# EAGLE design LEDPoet (EAGLE 6.1)
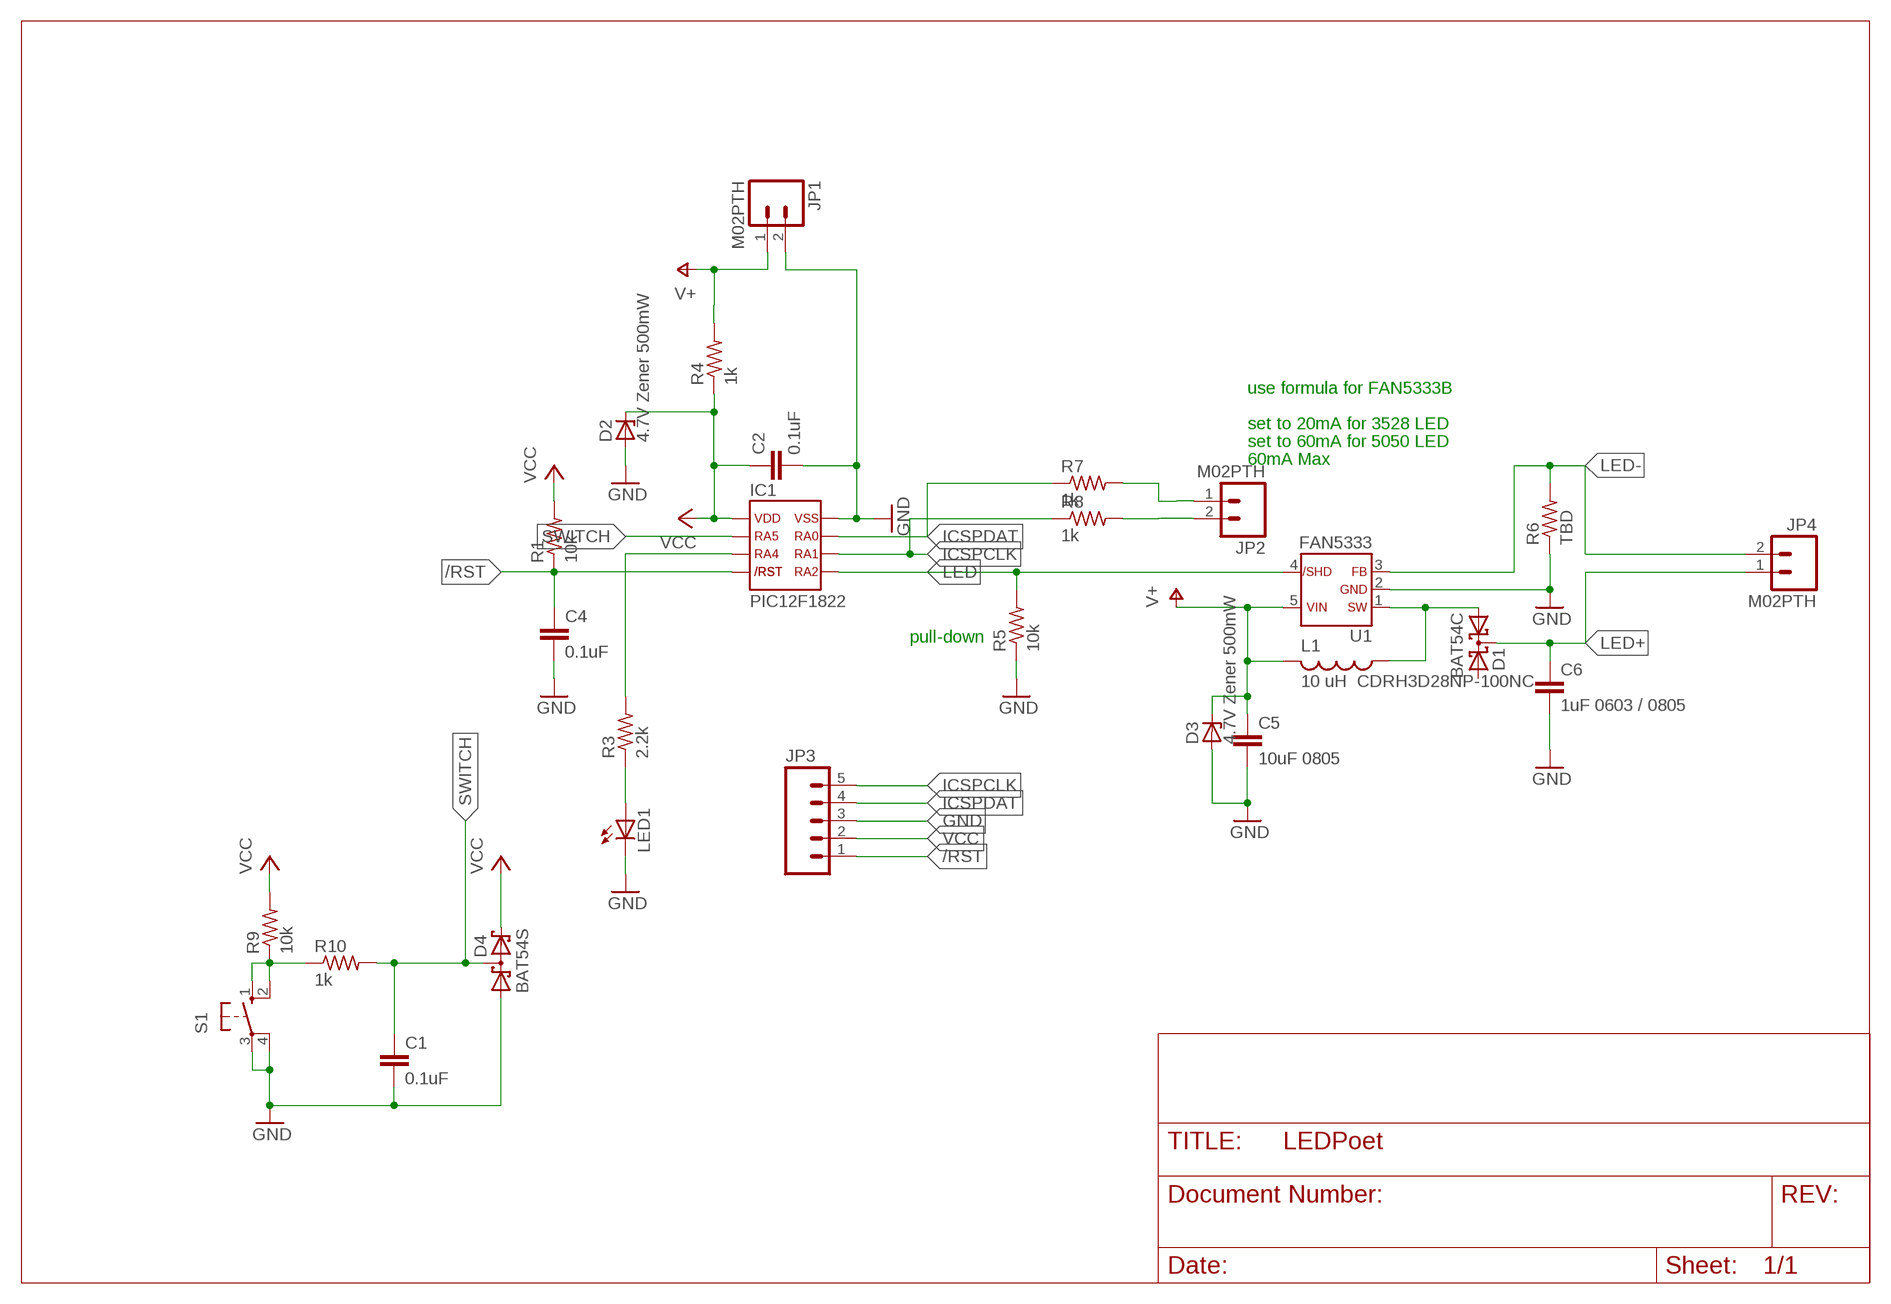
[diagram p0: schematic, sheet 1]

## Parts
C1  0.1uF  C0603(1608)  [C0603(1608)]
C2  0.1uF  C0603(1608)  [C0603(1608)]
C4  0.1uF  C0603(1608)  [C0603(1608)]
C5  10uF 0805  C0805(2012)  [C0805(2012)]
C6  1uF 0603 / 0805  C0805(2012)  [C0805(2012)]
D1  BAT54C  [SOT23]
D2  4.7V Zener 500mW  ZENER-DIODE  [SOD-123]
D3  4.7V Zener 500mW  ZENER-DIODE  [SOD-123]
D4  BAT54S  [SOT23]
IC1  PIC12F1822  [SO8]
JP1  M02PTH  [1X02]
JP2  M02PTH  [1X02]
JP3  M05PTH  [1X05]
JP4  M02PTH  [1X02]
L1  10 uH CDRH3D28NP-100NC  L  [CDRH3D18]
LED1  LED0603  [LED-0603]
R1  10k  R0603(1608)  [R0603(1608)]
R3  2.2k  R0603(1608)  [R0603(1608)]
R4  1k  R0603(1608)  [R0603(1608)]
R5  10k  R0603(1608)  [R0603(1608)]
R6  TBD  R0603(1608)  [R0603(1608)]
R7  1k  R0603(1608)  [R0603(1608)]
R8  1k  R0603(1608)  [R0603(1608)]
R9  10k  R0603(1608)  [R0603(1608)]
R10  1k  R0603(1608)  [R0603(1608)]
S1  40-XX  [B3F-40XX]
U1  FAN5333  [SOT-23-5]

## Nets
/RST: C4.1 IC1.4 JP3.1 R1.1
GND: C1.2 C2.2 C4.2 C5.2 C6.2 D2.A D3.A D4.1(A1) IC1.8 JP1.2 JP3.3 LED1.C R5.1 R6.1 S1.3(P) S1.4(P1) U1.2
ICSPCLK: IC1.6 JP3.5 R8.1
ICSPDAT: IC1.7 JP3.4 R7.1
LED: IC1.5 R5.2 U1.4
LED+: C6.1 D1.3(CC) JP4.1
LED-: JP4.2 R6.2 U1.3
N$2: LED1.A R3.1
N$3: IC1.3 R3.2
N$4: JP2.1 R7.2
N$5: D1.1(A1) L1.P$1 U1.1
N$6: R9.1 R10.1 S1.1(S) S1.2(S1)
N$7: JP2.2 R8.2
SWITCH: C1.1 D4.3(C1A2) IC1.2 R10.2
V+: C5.1 D3.C JP1.1 L1.P$2 R4.2 U1.5
VCC: C2.1 D2.C D4.2(C2) IC1.1 JP3.2 R1.2 R4.1 R9.2
Unconnected: D1.2(A2)

## Notes on the sheet
- use formula for FAN5333B
- set to 20mA for 3528 LED
- set to 60mA for 5050 LED
- 60mA Max
- pull-down

## Library data of the parts
C1 C2 C4 = WaterDrop:C
C5 C6 = LEDPoet:C
D1 = diode:BAT54C: Schottky Diodes Source: Fairchild .. BAT54.pdf
D2 D3 = LEDPoet:ZENER-DIODE
D4 = OSSI:BAT54S: Schottky Diodes Pin connection corrected 2011-05-04 Source: Fairchild .. BAT54.pdf
IC1 = WaterDrop:PIC12F1822
JP1 JP2 JP4 = SparkFun-Connectors:M02: Standard 2-pin 0.1" header. Use with - straight break away headers ( PRT-00116) - right angle break away headers (PRT-00553) - swiss pins (PRT-00743) - machine pins (PRT-00117) - female headers (PRT-00115) Molex polarized connector foot print use with: PRT-08233 with associated crimp pins and housings. 2.54_SCREWTERM for use with PRT-10571. 3.5mm Screw Terminal footprints for PRT-08084 5mm Screw Terminal footprints for use with PRT-08433
JP3 = SparkFun-Connectors:M05: Header 5 Standard 5-pin 0.1" header. Use with straight break away headers (SKU : PRT-00116), right angle break away headers (PRT-00553), swiss pins (PRT-00743), machine pins (PRT-00117), and female headers (PRT-00115). Molex polarized connector foot print use with SKU : PRT-08230 with associated crimp pins and housings.
L1 = OSSI:L
LED1 = SparkFun:LED: LEDs Standard schematic elements and footprints for 5mm, 3mm, 1206, and 0603 sized LEDs. 5mm - Spark Fun Electronics SKU : COM-00529 (and others)
R1 R3-R10 = WaterDrop:R
S1 = switch-omron:40-XX: OMRON SWITCH; MF: OMRON COMPONENTS USA; MPN: B3F-4000; OC_FARNELL: 176434; OC_NEWARK: 36K3105
U1 = LEDPoet:FAN5333

## Board
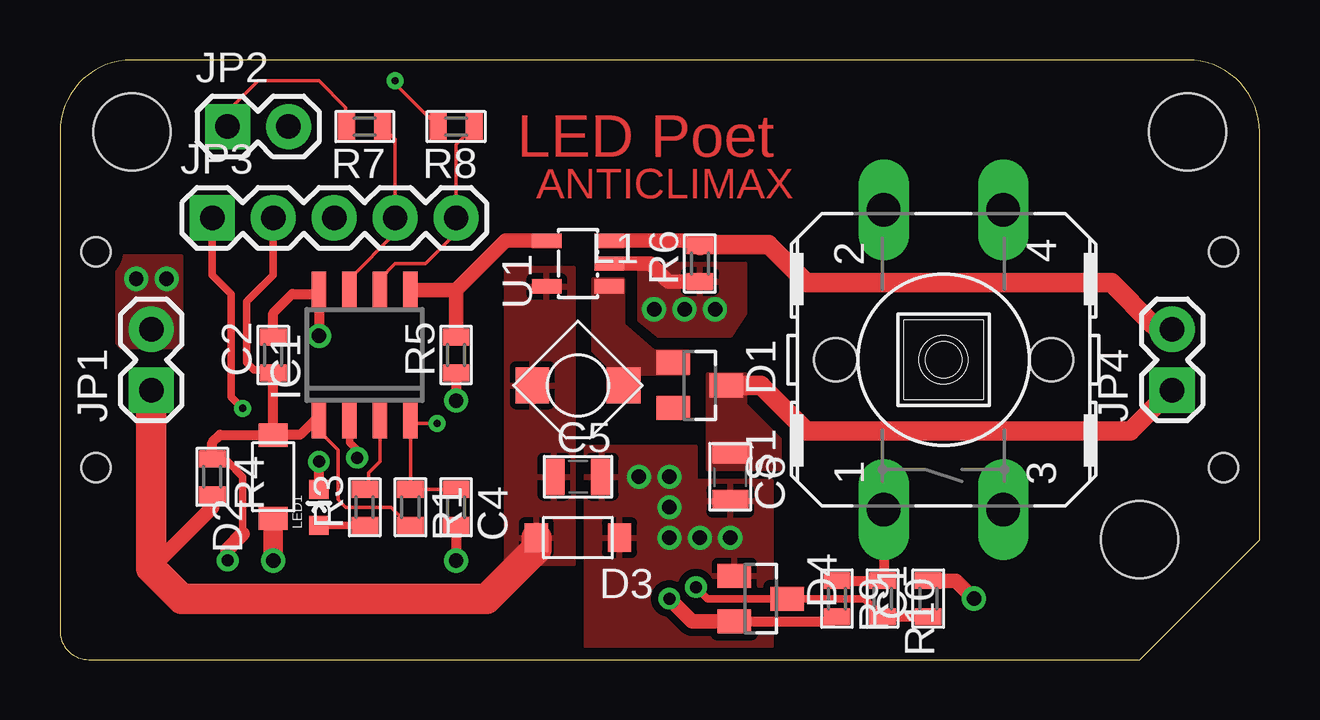
[diagram p1: board, top side]
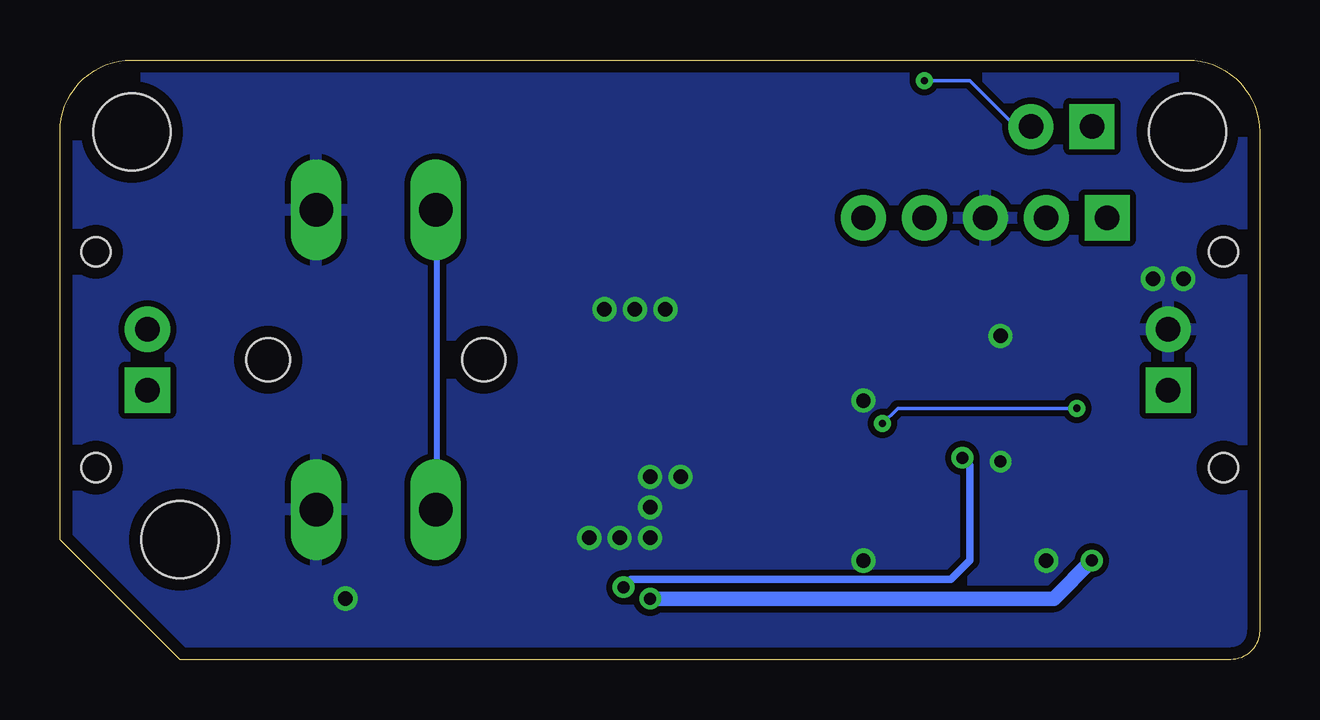
[diagram p2: board, bottom side, seen from below]

Size 50 x 25 mm. Coordinates in mm from the lower left corner, seen from the top.
Outline: 0,22 0,1.2 arc90 1.2,0 45,0 50,5 50,22 arc90 47,25 3,25 arc90 0,22
Copper layers (1*16): Top 0.035mm / dielectric 1.5mm / Bottom 0.035mm
Design rules: minimum track width 10mil, minimum drill 24mil, track to track 8mil, track to pad 8mil, pad to pad 8mil, via to via 8mil, smd to smd 8mil, copper to edge 20mil, drill to drill 8mil, minimum pad ring 10mil, minimum via ring 8mil, stop-mask expansion 4mil, vias tented up to drill 0mil, thermal gap 10mil
Holes 3.2 mm at 47,22 3,22 45,5
Holes 1.2 mm at 1.5,8 1.5,17 48.5,8 48.5,17

### Footprints (pad centres in the part's own frame; a part is rotated, then mirrored left to right if it is on the bottom)
C0603(1608) = smd 0.7 x 1.1: 1 -0.75,0; 2 0.75,0
C0805(2012) = smd 0.9 x 1.5: 1 -1,0; 2 1,0
SOT23 = smd 1 x 1.4: 1 -0.95,-1.1; 2 0.95,-1.1; 3 0,1.1
SOD-123 = smd 0.97 x 1.2: A -1.735,0; C 1.735,0
SO8 = smd 0.6 x 1.55: 1 -1.905,-2.7; 2 -0.635,-2.7; 3 0.635,-2.7; 4 1.905,-2.7; 5 1.905,2.7; 6 0.635,2.7; 7 -0.635,2.7; 8 -1.905,2.7
1X02 = drill 1.016 pad 1.88 square: 1 0,0 | drill 1.016 pad 1.88: 2 2.54,0
1X05 = drill 1.016 pad 1.88 square: 1 0,0 | drill 1.016 pad 1.88: 2 2.54,0; 3 5.08,0; 4 7.62,0; 5 10.16,0
CDRH3D18 = smd 1.4 x 1.5: P$1 -1.9,0; P$2 1.9,0
LED-0603 = smd 0.8 x 0.8: A 0,-0.75; C 0,0.75
R0603(1608) = smd 0.7 x 1.1: 1 -0.75,0; 2 0.75,0
B3F-40XX = drill 1.397 long: 1 -6.248,2.489; 2 6.248,2.489; 3 -6.248,-2.489; 4 6.248,-2.489 | hole 1.803: 0,-4.496; 0,4.496
SOT-23-5 = smd 0.6 x 1.22: 1 -0.95,-1.3; 2 0,-1.3; 3 0.95,-1.3; 4 0.95,1.3; 5 -0.95,1.3

### Placement (x,y rotation side)
C1  36.2,2.54 90 top
C2  8.89,12.7 90 top
C4  16.51,6.35 270 top
C5  21.59,7.62 0 top
C6  27.94,7.62 270 top
D1  26.67,11.43 270 top
D2  8.89,7.62 90 top
D3  21.59,5.08 180 top
D4  29.21,2.54 270 top
IC1  12.7,12.7 0 top
JP1  3.81,11.23 90 top
JP2  6.99,22.23 0 top
JP3  6.35,18.41 0 top
JP4  46.35,11.23 90 top
L1  21.59,11.43 180 top
LED1  10.79,6.35 0 top
R1  14.61,6.35 270 top
R3  12.7,6.35 90 top
R4  6.35,7.62 270 top
R5  16.51,12.7 90 top
R6  26.67,16.51 90 top
R7  12.7,22.23 180 top
R8  16.51,22.23 180 top
R9  32.38,2.54 270 top
R10  34.29,2.54 270 top
S1  36.83,12.5 90 top
U1  21.59,16.51 90 top

### Tracks (layer width: path | path; a pad name or v marks a point on that pad's centre or on a via)
/RST  (via drill 0.3)
  Top 0.152: C4.1 R1.1 IC1.4 14.76,9.84 v15.72,9.84
  Top 0.305: JP3.1 6.35,16.03 7.14,15.24 7.14,10.95 v7.62,10.48
  Bottom 0.152: v7.62,10.48 15.08,10.48 v15.72,9.84
GND  (via drill 0.5, 0.6)
  Top 0.406: R5.1 v16.51,10.79 | C4.2 v16.51,4.13 | LED1.C v10.79,8.26 | C2.2 8.89,14.45 9.68,15.24 10.63,15.24 IC1.8 v10.79,13.49
  Top 0.61: U1.2 24.61,16.51 25.24,15.88 25.36,15.76 R6.1 | C1.2 37.35,3.29 v38.1,2.54
  Top 0.813: D2.A v8.89,4.13
  other vias: 25.4,5.08 25.4,6.35 25.4,7.62 24.77,14.61 26.04,14.61 27.3,14.61 27.94,5.08 26.67,5.08 24.13,7.62 3.17,15.88 4.45,15.88
  pour Bottom (isolate 0.254): 0,25.4 50.8,25.4 50.8,0 0,0
  pour Top (isolate 0.305): 21.91,0.16 21.91,8.89 26.51,8.89 26.51,7.46 29.69,7.46 29.69,0.16
  pour Top: 24.13,16.51 28.57,16.51 28.57,14.45 27.94,13.49 24.92,13.49 24.13,14.13
  pour Top (no thermals): 2.54,13.02 5.08,13.02 5.08,16.83 2.38,16.83 2.38,13.18
ICSPCLK
  Top 0.152: R8.1 16.51,21.48 JP3.5 16.51,17.78 15.24,16.51 13.97,16.51 13.34,15.88 IC1.6
ICSPDAT
  Top 0.152: R7.1 13.97,21.7 JP3.4 13.97,17.78 12.06,15.88 IC1.7
LED
  Top 0.61: IC1.5 16.51,15.4 | 16.51,15.4 18.41,17.3 18.57,17.46 U1.4 | R5.2 16.51,15.4
LED+
  Top 0.813: D1.3 29.21,11.43 31.11,9.53 44.13,9.53 44.61,9.53 46.33,11.24 arc-135 JP4.1
  pour Top (no thermals): 27.15,11.91 28.57,11.91 28.57,10.95 28.57,10.64 30,9.21 30,8.1 30,7.94 26.99,7.94 26.99,11.91
LED-
  Top 0.61: U1.3 26.47,17.46 R6.2
  Top 0.813: R6.2 26.71,17.3 29.53,17.3 31.11,15.72 43.81,15.72 45.56,13.97 45.76,13.77 JP4.2
N$2
  Top 0.305: R3.1 LED1.A
N$3
  Top 0.152: IC1.3 13.34,8.26 12.86,7.78 12.86,6.99 12.81,6.99 R3.2
N$4
  Top 0.152: JP2.1 6.99,22.86 8.26,24.13 10.79,24.13 11.91,23.02 11.95,22.34 R7.2
N$5
  pour Top (no thermals): 22.86,12.22 22.86,10.79 24.13,10.79 24.13,11.91 26.19,11.91 26.19,12.86 24.77,12.86 23.5,13.97 23.5,15.88 22.23,15.88 22.23,12.86
N$6
  Top 0.406: S1.1 34.34,3.38 34.29,3.33 R10.1 R9.1
  Bottom 0.254: S1.2 34.29,17.78 34.29,7.62 S1.1
N$7  (via drill 0.3)
  Top 0.152: v13.97,24.13 13.97,24.02 R8.2
  Bottom 0.152: JP2.2 10.16,22.23 12.06,24.13 v13.97,24.13
SWITCH  (via drill 0.5)
  Top 0.305: R10.2 33.54,2.54 D4.3 26.99,2.54 v26.51,3.02 | v12.38,8.41 12.38,8.73 12.06,9.05 IC1.2
  Top 0.406: C1.1 R10.2
  Bottom 0.305: v26.51,3.02 26.19,3.33 12.86,3.33 12.06,4.13 12.06,8.1 v12.38,8.41
V+
  Top 0.61: R4.2 6.35,6.35 3.81,3.81
  Top 1.27: JP1.1 3.81,3.81 5.08,2.54 17.78,2.54 19.05,3.81 19.86,4.62 D3.C
  pour Top (isolate 0.406): 21.43,16.35 18.57,16.35 18.57,3.97 21.43,3.97
VCC  (via drill 0.5)
  Top 0.152: IC1.1 10.79,9.53 11.59,8.73 11.59,6.67 11.91,6.35 13.81,6.35 14.61,5.56 R1.2
  Top 0.305: JP3.2 8.89,16.03 7.78,14.92 7.78,12.38 8.1,12.06 8.78,12.06 C2.1 | 7.62,5.24 7.62,7.62 6.99,8.26 6.46,8.26 R4.1
  Top 0.406: R4.1 6.35,9.05 6.67,9.37 D2.C | D2.C | D2.C C2.1 | IC1.1 10.63,10 10,9.37 D2.C | D2.C | D4.2 32.19,1.59 R9.2
  Top 0.61: D4.2 26.35,1.59 v25.4,2.54 | v6.99,4.13 6.99,4.6 7.62,5.24
  Bottom 0.61: v25.4,2.54 8.57,2.54 v6.99,4.13

### Text on the board
Top: LED Poet | ANTICLIMAX
tStop: LED Poet | ANTICLIMAX